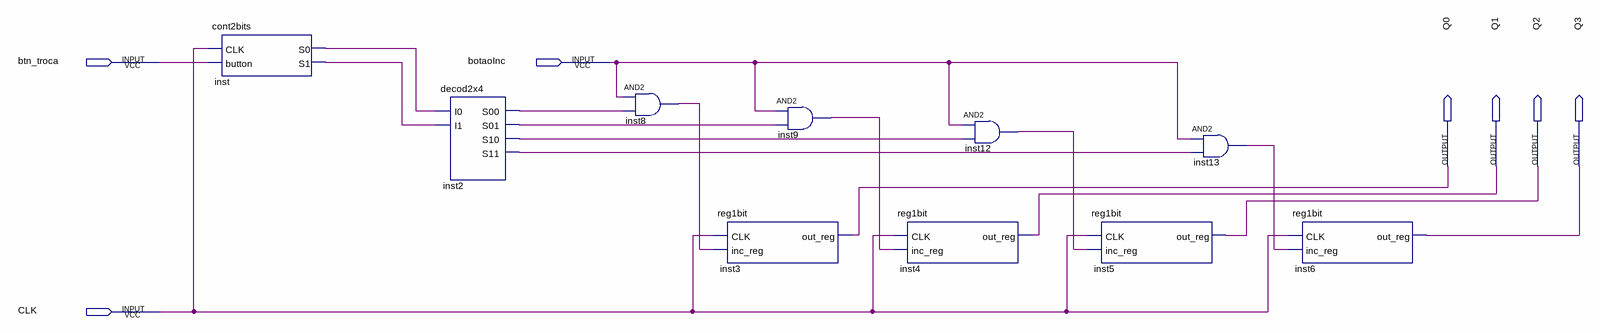
[diagram p0: schematic sheet]
// Quartus schematic regUser4bits.bdf as structural Verilog: 10 symbols, 7 pins
module regUser4bits (
  input  btn_troca,
  input  botaoInc,
  input  CLK,
  output Q0,
  output Q1,
  output Q2,
  output Q3
);

  wire inst2_s00, inst2_s01, inst2_s10, inst2_s11, inst8_out, inst9_out, inst12_out, inst13_out, inst_s0,
       inst_s1;

  cont2bits inst (.CLK(CLK), .button(btn_troca), .S0(inst_s0), .S1(inst_s1));
  decod2x4 inst2 (.I0(inst_s0), .I1(inst_s1), .S00(inst2_s00), .S01(inst2_s01), .S10(inst2_s10), .S11(inst2_s11));
  and inst8 (inst8_out, botaoInc, inst2_s00);
  reg1bit inst3 (.CLK(CLK), .inc_reg(inst8_out), .out_reg(Q0));
  and inst9 (inst9_out, botaoInc, inst2_s01);
  reg1bit inst4 (.CLK(CLK), .inc_reg(inst9_out), .out_reg(Q1));
  and inst12 (inst12_out, botaoInc, inst2_s10);
  reg1bit inst5 (.CLK(CLK), .inc_reg(inst12_out), .out_reg(Q2));
  and inst13 (inst13_out, botaoInc, inst2_s11);
  reg1bit inst6 (.CLK(CLK), .inc_reg(inst13_out), .out_reg(Q3));
endmodule
